# Altium schematic sheet EXTIO.SchDoc
size A; SheetNumber: 6; SheetTotal: 6
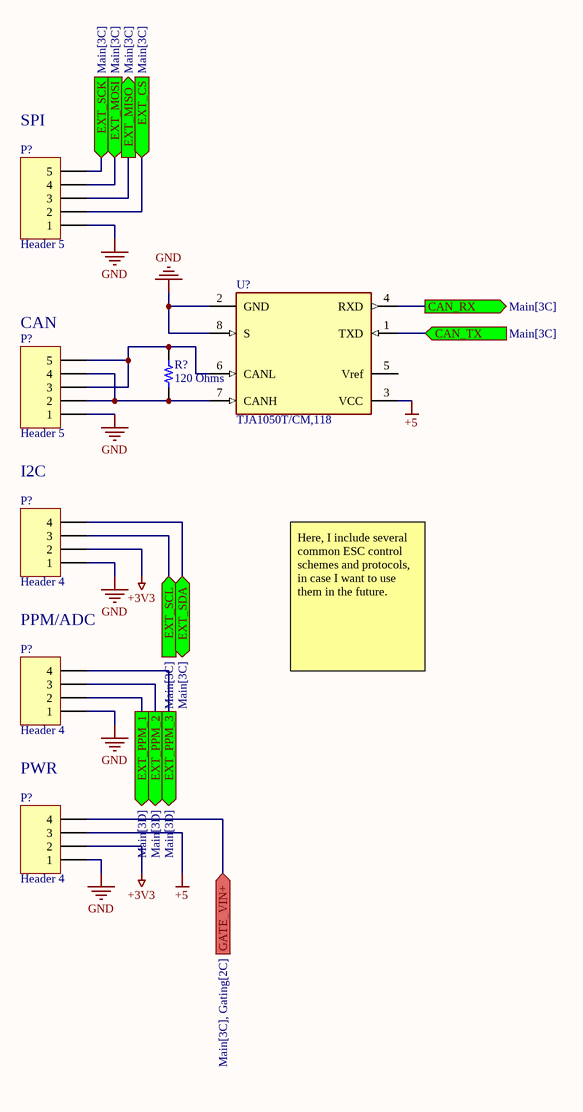
[diagram p0: EXTIO.SchDoc]

## Parts
(Parts that share a designator on the sheet are numbered #1, #2 ... from top to bottom, then left to right.)
P?#1  Header 5  [HDR1X5]
P?#2  Header 5  [HDR1X5]
P?#3  Header 4  [HDR1X4]
P?#4  Header 4  [HDR1X4]
P?#5  Header 4  [HDR1X4]
R?  120 Ohms  [RES 0603_1608]
U?  TJA1050T/CM,118  [FP-SOT96-1-IPC_A]

## Ports
CAN_RX (out, see Main[3C]), CAN_TX (in, see Main[3C]), EXT_CS (in, see Main[3C]), EXT_MISO (out, see Main[3C]), EXT_MOSI (in, see Main[3C]), EXT_PPM_1 (out, see Main[3D]), EXT_PPM_2 (out, see Main[3D]), EXT_PPM_3 (out, see Main[3D]), EXT_SCK (in, see Main[3C]), EXT_SCL (in, see Main[3C]), EXT_SDA (bidir, see Main[3C]), GATE_VIN+ (in, see Main[3C], Gating[2C])

## Nets
+3V3: P?#3.2 P?#5.2
+5: P?#5.3 U?.3(VCC)
GND: P?#1.1 P?#2.1 P?#3.1 P?#4.1 P?#5.1 U?.2(GND) U?.8(S)
CAN_RX: U?.4(RXD) ; port CAN_RX
CAN_TX: U?.1(TXD) ; port CAN_TX
EXT_CS: P?#1.2 ; port EXT_CS
EXT_MISO: P?#1.3 ; port EXT_MISO
EXT_MOSI: P?#1.4 ; port EXT_MOSI
EXT_PPM_1: P?#4.2 ; port EXT_PPM_1
EXT_PPM_2: P?#4.3 ; port EXT_PPM_2
EXT_PPM_3: P?#4.4 ; port EXT_PPM_3
EXT_SCK: P?#1.5 ; port EXT_SCK
EXT_SCL: P?#3.3 ; port EXT_SCL
EXT_SDA: P?#3.4 ; port EXT_SDA
GATE_VIN+: P?#5.4 ; port GATE_VIN+
NetP?#2_2: P?#2.2 P?#2.4 R?.1 U?.7(CANH)
NetP?#2_3: P?#2.3 P?#2.5 R?.2 U?.6(CANL)

Not connected (* = marked no-connect by the designer): U? 5(Vref)

## Notes on the sheet
- (near P?#1) SPI
- (near P?#2) CAN
- (near P?#3) I2C
- (near P?#4) PPM/ADC
- Here, I include several common ESC control schemes and protocols, in case I want to use them in the future.
- (near P?#5) PWR

## Library data of the parts
P?#1 P?#2 = Header 5: Header, 5-Pin; LatestRevisionDate: 17-Jul-2002; LatestRevisionNote: Re-released for DXP Platform.; Publisher: Altium Limited
P?#3-P?#5 = Header 4: Header, 4-Pin; LatestRevisionDate: 17-Jul-2002; LatestRevisionNote: Re-released for DXP Platform.; Publisher: Altium Limited
R? = AC0603FR-07120RL: RES SMD 120 OHM 1% 1/10W 0603; Manufacturer: Yageo; Power (Watts): 0.1W, 1/10W; Temperature Coefficient: ±100ppm/°C; Part Number: AC0603FR-07120RL; Value: 120 Ohms; ComponentLink1Description: Datasheet; ComponentLink1URL: https://www.yageo.com/upload/media/product/productsearch/datasheet/rchip/PYu-AC_51_RoHS_L_7.pdf; ComponentLink2Description: DigiKey Link; ComponentLink2URL: https://www.digikey.com/en/products/detail/yageo/AC0603FR-07120RL/5895761; Composition: Thick Film; Device Package: 0603 (1608 Metric); Features: Automotive AEC-Q200, Moisture Resistant; Height - Seated (Max): 0.022" (0.55mm); LastUpdated: 2/5/2023 8:27:27 PM; Lifecycle Status: Active; Minimum Order: 1; Number of Terminations: 2; Operating Temperature: -55°C ~ 155°C; Package / Case: 0603 (1608 Metric); Packaging: CutTape; PartId: 17447; Part Status: Active; Price: 0.01; Ratings: AEC-Q200; Resistance: 120 Ohms; Series: AC; Size / Dimension: 0.063" L x 0.031" W (1.60mm x 0.80mm); Supplier 1: DigiKey; Supplier Part Number 1: YAG3563CT-ND; Supplier Device Package: 0603; Tolerance: ±1%
U? = CMP-2000-04923-2: IC TRANSCEIVER HALF 1/1 8SO; Simplex/Duplex: Half Duplex; Max Supply Current: 10mA; Number of Receive Buffers: 1; Min Supply Voltage: 4.75V; Max Supply Voltage: 5.25V; Interface: CAN; Data Rate: 1Mbps; Receiver Hysteresis: 70mV; Number of Transmit Buffers: 1; Min Operating Temperature: -40°C; Case/Package: SO; REACH SVHC: No SVHC; Max Operating Temperature: 150°C; Number of Pins: 8; Lead Free: Lead Free; Number of Transceivers: 1; Packaging: Tape and Reel; Mount: Surface Mount; Radiation Hardening: No; Nominal Supply Current: 10mA; Package Quantity: 2500; Contact Plating: Gold